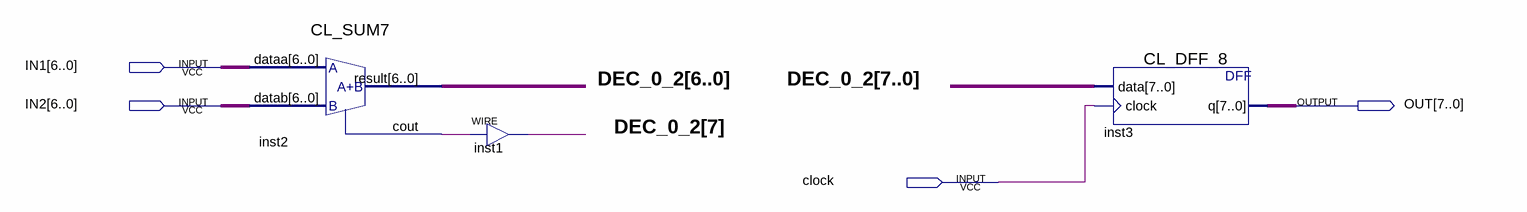
[diagram p0: schematic sheet]
// Quartus schematic CL_SUM7_BL.bdf as structural Verilog: 3 symbols, 4 pins
module CL_SUM7_BL (
  input  [6:0] IN1,
  input  [6:0] IN2,
  input  clock,
  output [7:0] OUT
);

  wire inst2_cout;
  wire [7:0] DEC_0_2;

  CL_SUM7 inst2 (.dataa(IN1), .datab(IN2), .result(DEC_0_2[6:0]), .cout(inst2_cout));
  assign DEC_0_2[7] = inst2_cout;  // WIRE inst1
  CL_DFF_8 inst3 (.data(DEC_0_2), .clock(clock), .q(OUT));
endmodule
